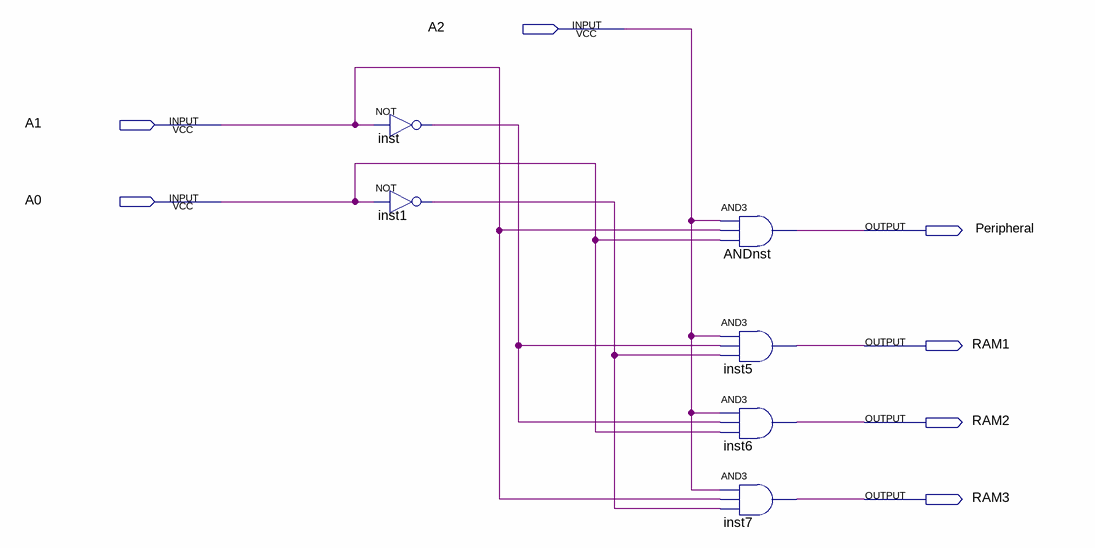
[diagram p0: schematic sheet]
// Quartus schematic RAM_decoder.bdf as structural Verilog: 6 symbols, 7 pins
module RAM_decoder (
  input  A2,
  input  A1,
  input  A0,
  output Peripheral,
  output RAM1,
  output RAM2,
  output RAM3
);

  wire inst1_out, inst_out;

  not inst (inst_out, A1);
  not inst1 (inst1_out, A0);
  and ANDnst (Peripheral, A2, A1, A0);
  and inst5 (RAM1, A2, inst_out, inst1_out);
  and inst6 (RAM2, A2, inst_out, A0);
  and inst7 (RAM3, A2, A1, inst1_out);
endmodule
